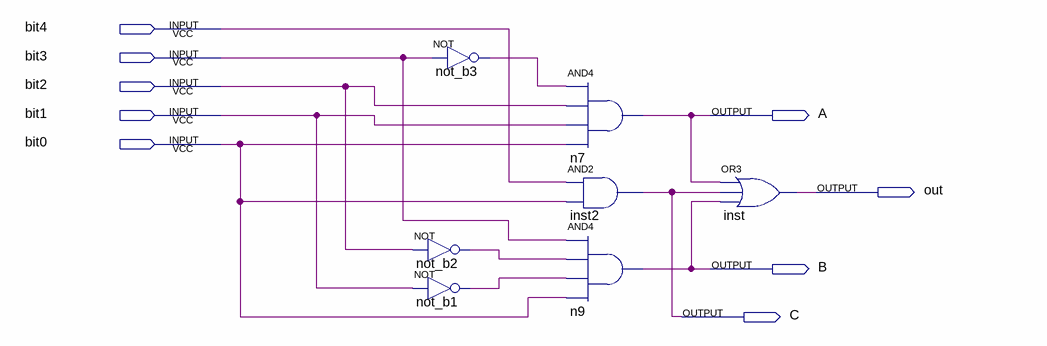
[diagram p0: schematic sheet]
// Quartus schematic controle_bits.bdf as structural Verilog: 7 symbols, 9 pins
module controle_bits (
  input  bit4,
  input  bit3,
  input  bit2,
  input  bit1,
  input  bit0,
  output A,
  output out,
  output B,
  output C
);

  wire not_b1_out, not_b2_out, not_b3_out;

  not not_b3 (not_b3_out, bit3);
  not not_b2 (not_b2_out, bit2);
  not not_b1 (not_b1_out, bit1);
  and n7 (A, not_b3_out, bit2, bit1, bit0);
  and inst2 (C, bit4, bit0);
  and n9 (B, bit3, not_b2_out, not_b1_out, bit0);
  or inst (out, A, C, B);
endmodule
